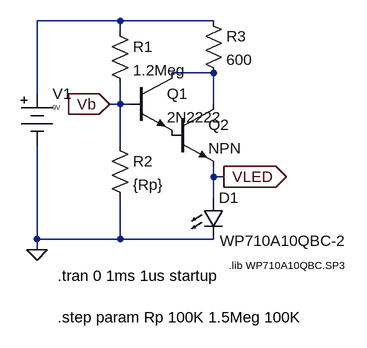
[diagram p0: schematic Photosensor.asc]
Photosensor.asc, the LTspice schematic file:
Version 4
SHEET 1 936 680
WIRE -64 -32 -192 -32
WIRE 80 -32 -64 -32
WIRE -64 -16 -64 -32
WIRE 80 48 16 48
WIRE -192 80 -192 -32
WIRE -64 96 -64 64
WIRE -64 96 -80 96
WIRE -48 96 -64 96
WIRE 80 96 80 48
WIRE -64 160 -64 96
WIRE 80 208 80 192
WIRE 96 208 80 208
WIRE 80 240 80 208
WIRE -192 304 -192 160
WIRE -64 304 -64 240
WIRE -64 304 -192 304
WIRE 80 304 -64 304
WIRE -192 320 -192 304
FLAG -192 320 0
FLAG -80 96 Vb
IOPIN -80 96 In
FLAG 96 208 VLED
IOPIN 96 208 Out
SYMBOL battery -192 64 R0
WINDOW 123 0 0 Left 0
WINDOW 3 24 38 Left 0
SYMATTR InstName V1
SYMATTR Value 9V
SYMATTR SpiceLine Rser=0
SYMBOL res -80 -32 R0
SYMATTR InstName R1
SYMATTR Value 1.2Meg
SYMBOL res -80 144 R0
SYMATTR InstName R2
SYMATTR Value {Rp}
SYMBOL npn -48 48 R0
SYMATTR InstName Q1
SYMATTR Value 2N2222
SYMBOL npn 16 96 R0
SYMATTR InstName Q2
SYMBOL res 64 -48 R0
SYMATTR InstName R3
SYMATTR Value 600
SYMBOL LED 64 240 R0
WINDOW 3 26 66 Left 2
SYMATTR InstName D1
SYMATTR Value WP710A10QBC-2
TEXT 104 344 Left 1 !.lib WP710A10QBC.SP3
TEXT -160 360 Left 2 !.tran 0 1ms 1us startup
TEXT -160 424 Left 2 !.step param Rp 100K 1.5Meg 100K

The netlist it stands for:
* Photosensor.asc
V1 N001 0 9V Rser=0
R1 N001 Vb 1.2Meg
R2 Vb 0 {Rp}
Q1 N002 Vb P001 0 2N2222
Q2 N002 P001 VLED 0 NPN
R3 N001 N002 600
D1 VLED 0 WP710A10QBC-2
.model D D
.lib standard.dio
.model NPN NPN
.model PNP PNP
.lib standard.bjt
.lib WP710A10QBC.SP3
.tran 0 1ms 1us startup
.step param Rp 100K 1.5Meg 100K
.backanno
.end